# EAGLE schematic restckt2 (EAGLE 7.2.0)
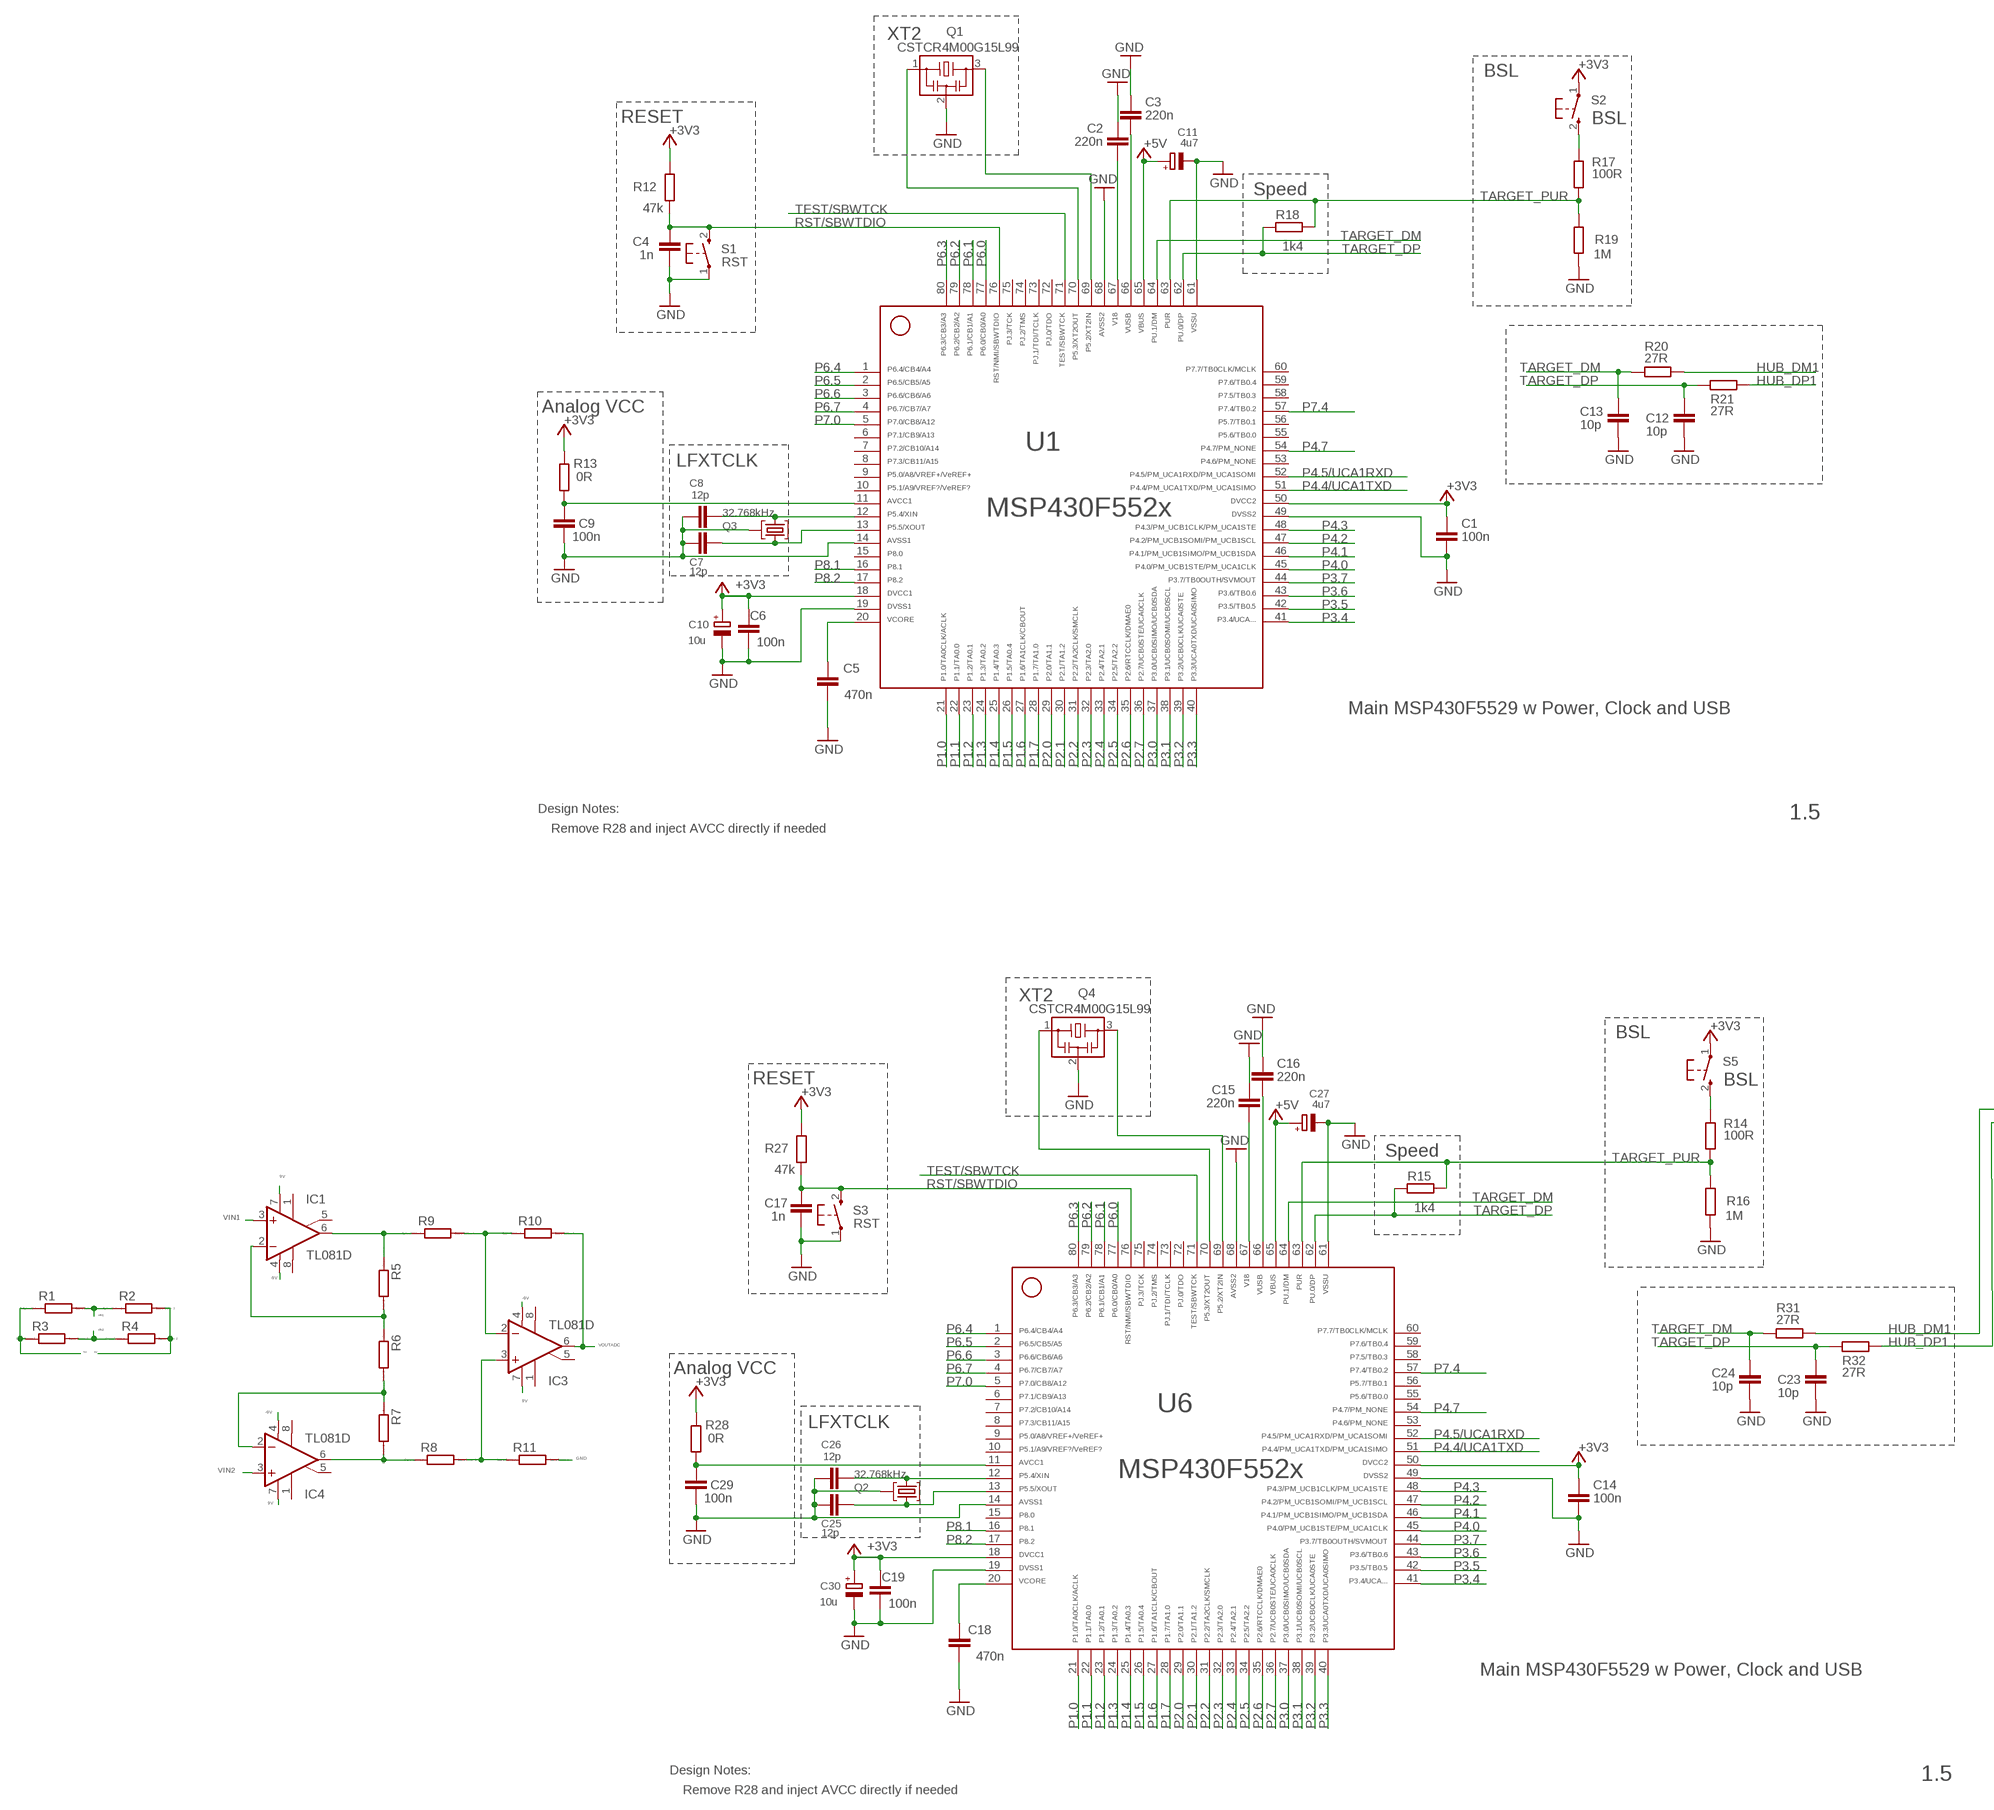
[diagram p0: schematic, sheet 1, part 1 of 2]
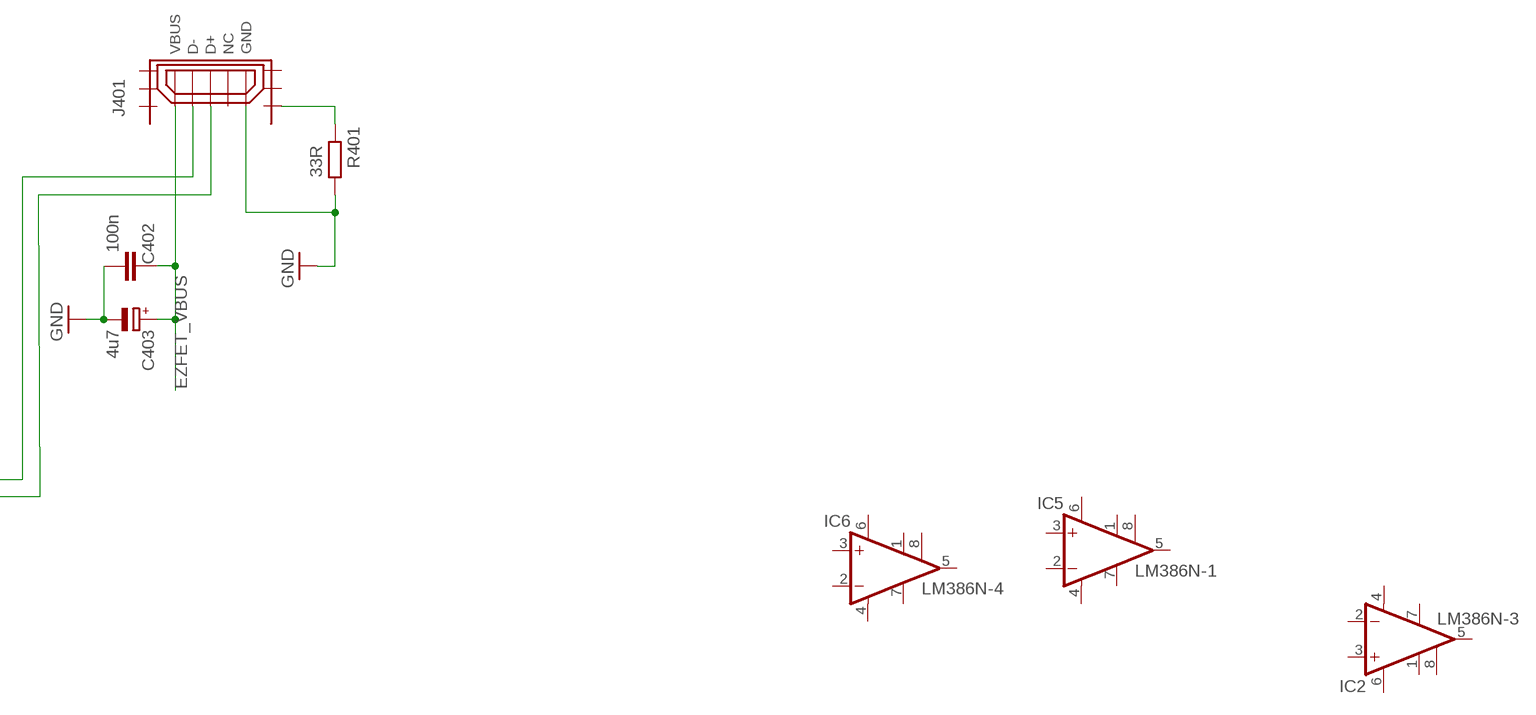
[diagram p1: schematic, sheet 1, part 2 of 2]

## Parts
C1  100n  C-EUC0402  [C0402]
C2  220n  C-EUC0402  [C0402]
C3  220n  C-EUC0402  [C0402]
C4  1n  C-EUC0402  [C0402]
C5  470n  C-EUC0402  [C0402]
C6  100n  C-EUC0402  [C0402]
C7  12p  C-EUC0402  [C0402]
C8  12p  C-EUC0402  [C0402]
C9  100n  C-EUC0402  [C0402]
C10  10u  CPOL-EUA/3216-18R  [A/3216-18R]
C11  4u7  CPOL-EUA/3216-18R  [A/3216-18R]
C12  10p  C-EUC0402  [C0402]
C13  10p  C-EUC0402  [C0402]
C14  100n  C-EUC0402  [C0402]
C15  220n  C-EUC0402  [C0402]
C16  220n  C-EUC0402  [C0402]
C17  1n  C-EUC0402  [C0402]
C18  470n  C-EUC0402  [C0402]
C19  100n  C-EUC0402  [C0402]
C23  10p  C-EUC0402  [C0402]
C24  10p  C-EUC0402  [C0402]
C25  12p  C-EUC0402  [C0402]
C26  12p  C-EUC0402  [C0402]
C27  4u7  CPOL-EUA/3216-18R  [A/3216-18R]
C29  100n  C-EUC0402  [C0402]
C30  10u  CPOL-EUA/3216-18R  [A/3216-18R]
C402  100n  C-EUC0402  [C0402]
C403  4u7  CPOL-EUA/3216-18R  [A/3216-18R]
IC1  TL081D  [SO08]
IC2  LM386N-3  [DIL08]
IC3  TL081D  [SO08]
IC4  TL081D  [SO08]
IC5  LM386N-1  [DIL08]
IC6  LM386N-4  [DIL08]
J401  USB_MICRO_FLIPPED  [HIROSE-ZX62R-B-5P]
Q1  CSTCR4M00G15L99  MURATA-FILTER_CSTCR6M00G53Z  [MURATA-FILTER_CSTCR]
Q2  32.768kHz  MS3V-T1R  [MS3V-T1R]
Q3  32.768kHz  MS3V-T1R  [MS3V-T1R]
Q4  CSTCR4M00G15L99  MURATA-FILTER_CSTCR6M00G53Z  [MURATA-FILTER_CSTCR]
R1  R0207/10  [0207/10]
R2  R0207/10  [0207/10]
R3  R0207/10  [0207/10]
R4  R0207/10  [0207/10]
R5  R0207/10  [0207/10]
R6  R0207/10  [0207/10]
R7  R0207/10  [0207/10]
R8  R0207/10  [0207/10]
R9  R0207/10  [0207/10]
R10  R0207/10  [0207/10]
R11  R0207/10  [0207/10]
R12  47k  R-EU_R0402  [R0402]
R13  0R  R-EU_R0402  [R0402]
R14  100R  R-EU_R0402  [R0402]
R15  1k4  R-EU_R0402  [R0402]
R16  1M  R-EU_R0402  [R0402]
R17  100R  R-EU_R0402  [R0402]
R18  1k4  R-EU_R0402  [R0402]
R19  1M  R-EU_R0402  [R0402]
R20  27R  R-EU_R0402  [R0402]
R21  27R  R-EU_R0402  [R0402]
R27  47k  R-EU_R0402  [R0402]
R28  0R  R-EU_R0402  [R0402]
R31  27R  R-EU_R0402  [R0402]
R32  27R  R-EU_R0402  [R0402]
R401  33R  R-EU_R0402  [R0402]
S1  RST  PB  [PBTH]
S2  BSL  PB  [PBTH]
S3  RST  PB  [PBTH]
S5  BSL  PB  [PBTH]
U1  MSP430F5529IPNR  F552X---PN80  [PN80]
U6  MSP430F5529IPNR  F552X---PN80  [PN80]

## Nets
0V: R2.2 R4.2
5V: R1.1 R3.1
9V: IC1.7(V+) IC3.7(V+) IC4.7(V+)
+3V3 [Power]: C1.1 C6.2 C10.+ C14.1 C19.2 C30.+ R12.2 R13.2 R27.2 R28.2 S2.1(P) S5.1(P) U1.18 U1.50 U6.18 U6.50
+5V [Power]: C11.+ C27.+ U1.65 U6.65
-9V: IC1.4(V-) IC3.4(V-) IC4.4(V-)
AVCC [Power]: C29.1 R28.1 U6.11
AVCC1 [Power]: C9.1 R13.1 U1.11
EZFET_VBUS [Power]: C402.1 C403.+ J401.VBUS
GND: C1.2 C2.2 C3.2 C4.2 C5.1 C6.1 C7.1 C8.1 C9.2 C10.- C11.- C12.2 C13.2 C14.2 C15.2 C16.2 C17.2 C18.1 C19.1 C23.2 C24.2 C25.1 C26.1 C27.- C29.2 C30.- C402.2 C403.- J401.GND Q1.2 Q2.P3(GND) Q3.P3(GND) Q4.2 R11.2 R16.1 R19.1 R401.2 S1.1(P) S3.1(P) U1.14 U1.19 U1.49 U1.61 U1.68 U6.14 U6.19 U6.49 U6.61 U6.68
HUB_DM1: J401.D- R20.1 R31.1
HUB_DP1: J401.D+ R21.1 R32.1
N$1: IC3.2(-IN) R9.2 R10.1
N$2: IC1.6(OUT) R5.1 R9.1
N$3: IC1.2(-IN) R5.2 R6.1
N$4: IC4.2(-IN) R6.2 R7.1
N$5: IC4.6(OUT) R7.2 R8.1
N$6: IC3.3(+IN) R8.2 R11.1
N$7: R14.1 S5.2(S)
N$8: R17.1 S2.2(S)
N$10: J401.SHIELD1 R401.1
P1.0: U1.21 U6.21
P1.1: U1.22 U6.22
P1.2: U1.23 U6.23
P1.3: U1.24 U6.24
P1.4: U1.25 U6.25
P1.5: U1.26 U6.26
P1.6: U1.27 U6.27
P1.7: U1.28 U6.28
P2.0: U1.29 U6.29
P2.1: U1.30 U6.30
P2.2: U1.31 U6.31
P2.3: U1.32 U6.32
P2.4: U1.33 U6.33
P2.5: U1.34 U6.34
P2.6: U1.35 U6.35
P2.7: U1.36 U6.36
P3.0: U1.37 U6.37
P3.1: U1.38 U6.38
P3.2: U1.39 U6.39
P3.3: U1.40 U6.40
P3.4: U1.41 U6.41
P3.5: U1.42 U6.42
P3.6: U1.43 U6.43
P3.7: U1.44 U6.44
P4.0: U1.45 U6.45
P4.1: U1.46 U6.46
P4.2: U1.47 U6.47
P4.3: U1.48 U6.48
P4.4/UCA1TXD: U1.51 U6.51
P4.5/UCA1RXD: U1.52 U6.52
P4.7: U1.54 U6.54
P5.2/XT2IN: Q4.3 U6.69
P5.2/XT2IN1: Q1.3 U1.69
P5.3/XT2OUT: Q4.1 U6.70
P5.3/XT2OUT1: Q1.1 U1.70
P5.4/XIN: C26.2 Q2.P2 U6.12
P5.4/XIN1: C8.2 Q3.P2 U1.12
P5.5/XOUT: C25.2 Q2.P1 U6.13
P5.5/XOUT1: C7.2 Q3.P1 U1.13
P6.0: U1.77 U6.77
P6.1: U1.78 U6.78
P6.2: U1.79 U6.79
P6.3: U1.80 U6.80
P6.4: U1.1 U6.1
P6.5: U1.2 U6.2
P6.6: U1.3 U6.3
P6.7: U1.4 U6.4
P7.0: U1.5 U6.5
P7.4: U1.57 U6.57
P8.1: U1.16 U6.16
P8.2: U1.17 U6.17
RST/SBWTDIO: C4.1 C17.1 R12.1 R27.1 S1.2(S) S3.2(S) U1.76 U6.76
TARGET_DM: C13.1 C24.1 R20.2 R31.2 U1.64 U6.64
TARGET_DP: C12.1 C23.1 R15.2 R18.2 R21.2 R32.2 U1.62 U6.62
TARGET_PUR: R14.2 R15.1 R16.2 R17.2 R18.1 R19.2 U1.63 U6.63
TARGET_VUSB [Power]: C16.1 U6.66
TARGET_VUSB1 [Power]: C3.1 U1.66
TEST/SBWTCK: U1.71 U6.71
V1 [Power]: C2.1 U1.67
V18 [Power]: C15.1 U6.67
VCORE [Power]: C18.2 U6.20
VCORE1 [Power]: C5.2 U1.20
VIN1: IC1.3(+IN) R1.2 R2.1
VIN2: IC4.3(+IN) R3.2 R4.1
VOUTADC: IC3.6(OUT) R10.2
Unconnected: IC1.1(ON1) IC1.5(ON2) IC1.8(OPT) IC2.1(GAIN) IC2.2(-IN) IC2.3(+IN) IC2.5(OUT) IC2.7(BYPASS) IC2.8(GAIN) IC3.1(ON1) IC3.5(ON2) IC3.8(OPT) IC4.1(ON1) IC4.5(ON2) IC4.8(OPT) IC5.1(GAIN) IC5.2(-IN) IC5.3(+IN) IC5.5(OUT) IC5.7(BYPASS) IC5.8(GAIN) IC6.1(GAIN) IC6.2(-IN) IC6.3(+IN) IC6.5(OUT) IC6.7(BYPASS) IC6.8(GAIN) J401.NC J401.SHIELD2 J401.SHIELD3 J401.SHIELD4 J401.SHIELD5 J401.SHIELD6 U1.6 U1.7 U1.8 U1.9 U1.10 U1.15 U1.53 U1.55 U1.56 U1.58 U1.59 U1.60 U1.72 U1.73 U1.74 U1.75 U6.6 U6.7 U6.8 U6.9 U6.10 U6.15 U6.53 U6.55 U6.56 U6.58 U6.59 U6.60 U6.72 U6.73 U6.74 U6.75

## Notes on the sheet
- XT2
- BSL
- RESET
- Speed
- Analog VCC
- LFXTCLK
- Main MSP430F5529 w Power, Clock and USB
- Design Notes:
- 1.5
- Remove R28 and inject AVCC directly if needed
- XT2
- BSL
- RESET
- Speed
- Analog VCC
- LFXTCLK
- Main MSP430F5529 w Power, Clock and USB
- Design Notes:
- 1.5
- Remove R28 and inject AVCC directly if needed

## Power pins joined to a net without a drawn wire
GND: IC2.4(GND) IC5.4(GND) IC6.4(GND)
VS: IC2.6(VS) IC5.6(VS) IC6.6(VS)

## Library data of the parts
C1-C9 C12-C19 C23-C26 C29 C402 = rcl:C-EU: CAPACITOR, European symbol
C10 C11 C27 C30 C403 = rcl:CPOL-EU: POLARIZED CAPACITOR, European symbol
IC1 IC3 IC4 = linear:TL081: OP AMP
IC2 IC5 IC6 = linear:LM386?-*: Low Voltage Audio Power Amplifier Source: http://cache.national.com/ds/LM/LM386.pdf
J401 = usb_con-update:USB_MICRO_FLIPPED
Q1 Q4 = murata:MURATA-FILTER_CSTCR: Resonator Source: murata.co.jp; MPN: CSTCR6M00G53-R0; OC_FARNELL: 1170434; OC_NEWARK: 25M8759
Q2 Q3 = microcrystal:MS3V-T1R
R1-R11 = eagle-ltspice:R: RESISTOR, European symbol; SPICEMODEL: NONE; SPICEPREFIX: R
R12-R21 R27 R28 R31 R32 R401 = rcl:R-EU_: RESISTOR, European symbol
S1-S3 S5 = electricalmeter:PB: OMRON SWITCH
U1 U6 = TI_MSP430_v16_intern:F552X---PN80: ***MSP430F552X***PN80 http://www.ti.com/lit/gpn/msp430f5529 Rev1.0 06/2010 For F552X where X is 1,5,7,9

## Net classes
0 Default: width 0.203 mm, drill 0.305 mm, clearance 0.152 mm
1 Ground: width 0.203 mm, drill 0.305 mm, clearance 0.152 mm to class 0, clearance 0.152 mm
2 Power: width 0.203 mm, drill 0.305 mm, clearance 0.152 mm to class 0, clearance 0.152 mm to class 1, clearance 0.152 mm